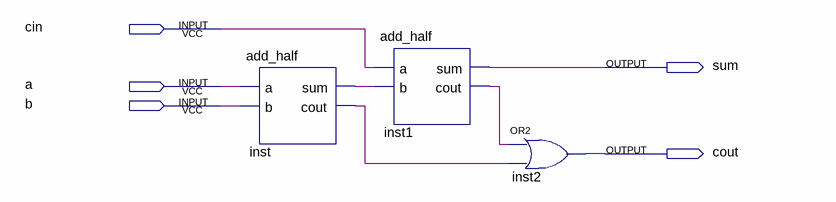
[diagram p0: schematic sheet]
// Quartus schematic add_full.bdf as structural Verilog: 3 symbols, 5 pins
module add_full (
  input  cin,
  input  a,
  input  b,
  output sum,
  output cout
);

  wire inst1_cout, inst_cout, inst_sum;

  add_half inst (.a(a), .b(b), .sum(inst_sum), .cout(inst_cout));
  add_half inst1 (.a(cin), .b(inst_sum), .sum(sum), .cout(inst1_cout));
  or inst2 (cout, inst1_cout, inst_cout);
endmodule
